# Altium schematic sheet 03_Power_Spply.SchDoc
size A3; SheetNumber: 3; SheetTotal: 8
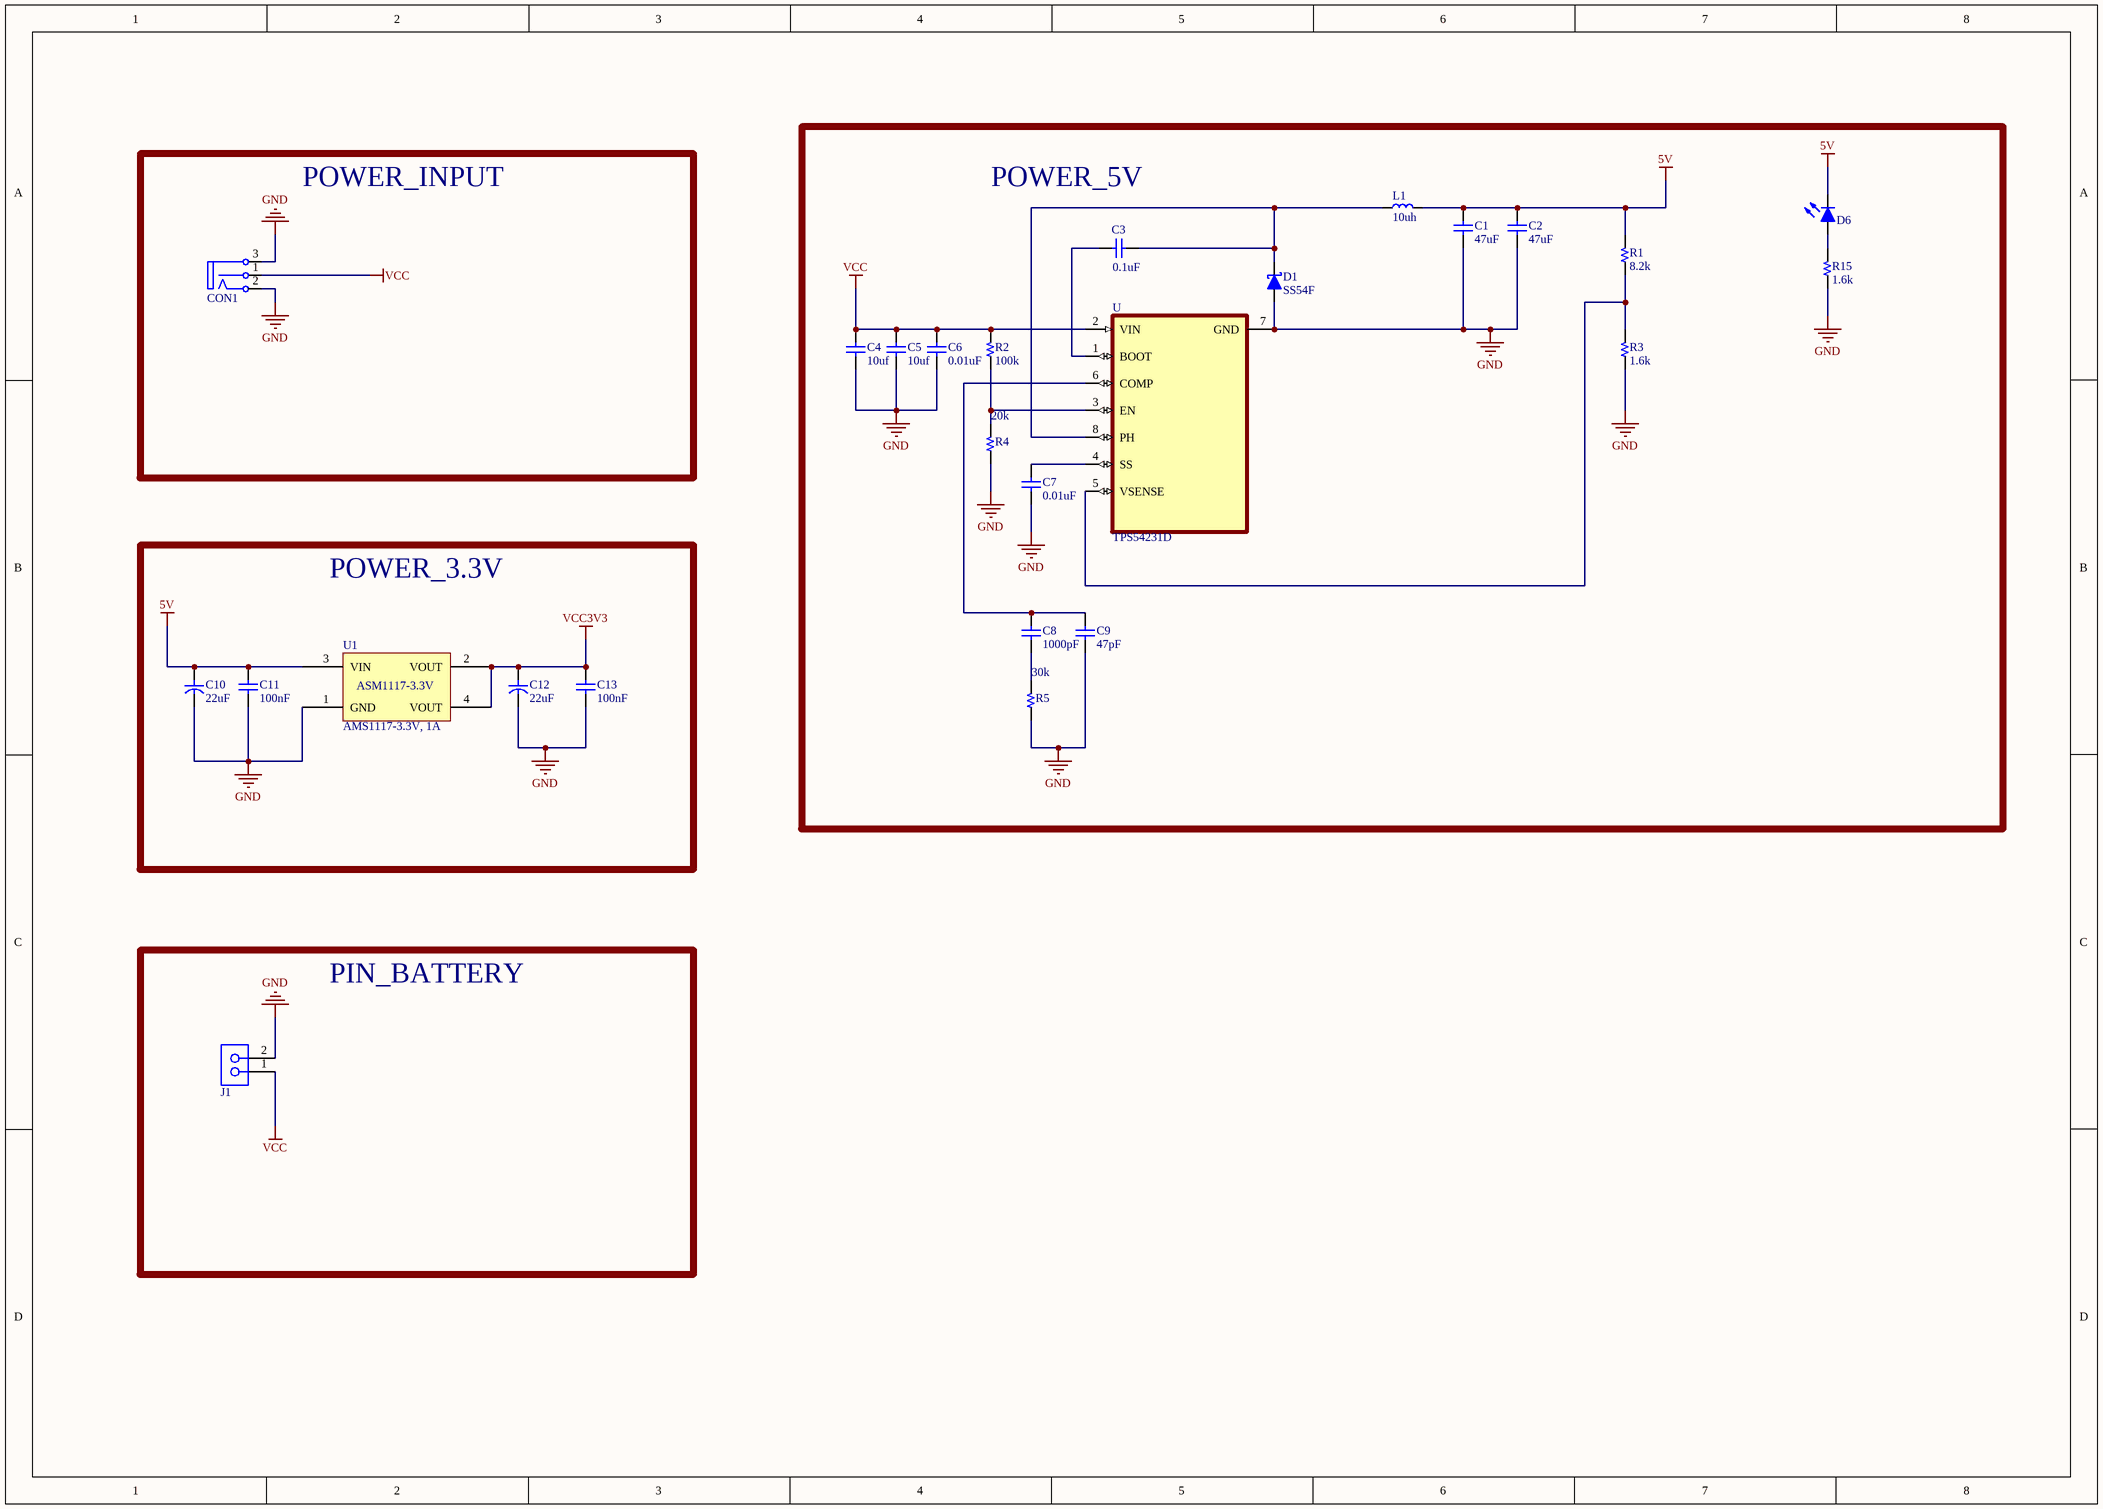
[diagram p0: 03_Power_Spply.SchDoc]

## Parts
C1  47uF  [C 0805]
C2  47uF  [C 0805]
C3  0.1uF  [C 0805]
C4  10uf  [C 0805]
C5  10uf  [C 0805]
C6  0.01uF  [C 0805]
C7  0.01uF  [C 0805]
C8  1000pF  [C 0805]
C9  47pF  [C 0805]
C10  22uF  [C SMD TAN 2312 (C)]
C11  100nF  [C 0805]
C12  22uF  [C SMD TAN 2312 (C)]
C13  100nF  [C 0805]
CON1  CON DC PWR  [CONN/DC/PWR/5.0MM]  (value not drawn)
D1  SS54F  [DO-214AC (SMA)]
D6  Led  [Led 0805]  (value not drawn)
J1  6A, 150V  [691402910002B]  (value not drawn)
L1  10uh  [Inductor SMD CDRH3D67]
R1  8.2k  [R 0805]
R2  100k  [R 0805]
R3  1.6k  [R 0805]
R4  20k  [R 0805]
R5  30k  [R 0805]
R15  1.6k  [R 0805]
U  TPS54231D  [SOIC127P599X175-8N]
U1  AMS1117-3.3V, 1A  [AMS1117-3.3V SOT223]

## Blocks framed on the sheet
POWER_5V: C1-C9 D1 D6 L1 R1-R5 R15 U
POWER_INPUT: CON1
POWER_3.3V: C10-C13 U1
PIN_BATTERY: J1

## Nets
5V: C1.2 C2.2 C10.1 C11.2 D6.2(K) L1.2 R1.2 U1.3(VIN)
GND: C1.1 C2.1 C4.1 C5.1 C6.1 C7.1 C9.1 C10.2 C11.1 C12.2 C13.1 CON1.2(T) CON1.3(TN) D1.1(A) J1.2 R3.1 R4.1 R5.1 R15.1 U.7(GND) U1.1(GND)
VCC: C4.2 C5.2 C6.2 CON1.1(S) J1.1 R2.2 U.2(VIN)
VCC3V3: C12.1 C13.2 U1.2(VOUT) U1.4(VOUT)
NetC3_1: C3.1 D1.2(K) L1.1 U.8(PH)
NetC3_2: C3.2 U.1(BOOT)
NetC7_2: C7.2 U.4(SS)
NetC8_1: C8.1 R5.2
NetC8_2: C8.2 C9.2 U.6(COMP)
NetD6_1: D6.1(A) R15.2
NetR1_1: R1.1 R3.2 U.5(VSENSE)
NetR2_1: R2.1 R4.2 U.3(EN)

## Notes on the sheet
- (in symbol AMS1117-3.3V) ASM1117-3.3V

## Library data of the parts
C1-C9 C11 C13 = Capacitor NP: Capacitor non-pol
C10 C12 = Capacitor: Capacitor pol
CON1 = CON DC PWR: DC input connector
D1 = Diode Schottky: Schottky Diode
D6 = Led: Typical LED
J1 = 691402910002B: WR-TBL Series 4029 Horizontal Entry, THT, pitch 2.54mm, 2p; Manufacturer: Wurth Elektronik; Modularity: No; ComponentLink1Description: Datasheet; ComponentLink1URL: https://www.we-online.com/redexpert/spec/691402910002B?ad; Manufacturer Part Number: 691402910002B; Category: Terminal Blocks; Match Code: WR-TBL; Mount: Through Hole; Operating Temperature Max: 105°C; Operating Temperature Min: -40°C; Packaging: Box; Application: Screwless; Number of Pins: 2; Number of Rows: 1; Orientation: Horizontal; Pitch: 2.54mm; Rated Current: 6A; Working Voltage: 150V; Supplier 1 URL: N/A; Supplier 2 URL: N/A; Supplier 3 URL: https://www.thegioiic.com/kf141-2-54-2-r-terminal-block-2-tiep-diem-cam-day-ngang-2-54mm-150v-2a; Value: 6A, 150V; LCSC Part #: N/A; Supplier 1: Mouser; Supplier 1 Part Number: N/A; Supplier 2: Digi-Key; Supplier 2 Part Number: N/A; Supplier 3: thegioiic; Supplier 3 Part Number: N/A
L1 = Inductor
R1-R5 R15 = Resistor
U = TPS54231D: å…·æœ‰Eco-modeï¼†tradeçš„3.5è‡³28Vè¾“å…¥ï¼Œ2Aï¼Œ570kHzé™åŽ‹è½¬æ¢å™¨ï¼›8-SOIC -40è‡³150; MF: Texas Instruments; DigiKey-Purchase-URL: https://snapeda.com/shop?store=DigiKey&id=456068; Value: *; MP: TPS54231D; Availability: Unavailable; Price: None; Texas_Instruments-Purchase-URL: https://snapeda.com/shop?store=Texas+Instruments&id=456068; Package: SOIC-8 Texas Instruments; SnapEDA_Link: https://www.snapeda.com/parts/TPS54231D/Texas%20Instruments/view-part/456068/?ref=snap
U1 = AMS1117-3.3V: 1A 60dB@(120Hz) Fixed 3.3V Positive electrode 12V SOT-223 Linear Voltage Regulators (LDO) ROHS; Manufacturer: AMS; Pad Count: 4; Voltage Input Maximum: 15V; Manufacturer Part Number: N/A; Current Input Maximum: N/A; Current Output Maximum: 1A; Voltage Output: 3.3V; Supplier 1 URL: N/A; Supplier 2 URL: N/A; Supplier 3 URL: https://www.thegioiic.com/ams1117-3-3v-ic-on-ap-3-3v-1a-sot-223; Value: AMS1117-3.3V, 1A; Mount: SMD/SMT; Operating Temperature Max: + 85 C; Operating Temperature Min: - 40 C; Packaging: Tape and Reel; Supplier 1: Mouser; Supplier 1 Part Number: N/A; Supplier 2: Digi-Key; Supplier 2 Part Number: N/A; Supplier 3: thegioiic; Supplier 3 Part Number: N/A; ComponentLink1Description: Datasheet; ComponentLink1URL: http://www.advanced-monolithic.com/pdf/ds1117.pdf; LCSC Part #: C347222